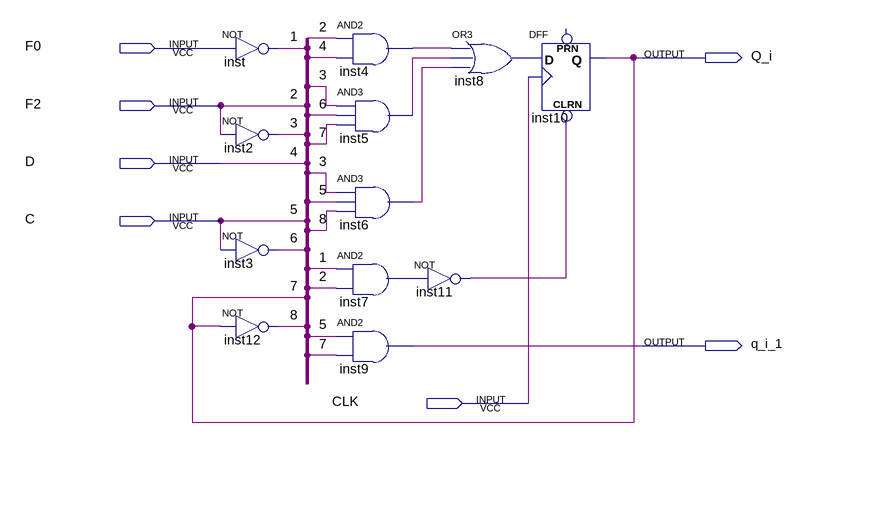
[diagram p0: schematic sheet]
// Quartus schematic CTR.bdf as structural Verilog: 12 symbols, 7 pins
module CTR (
  input  F0,
  input  F2,
  input  D,
  input  C,
  input  CLK,
  output Q_i,
  output q_i_1
);

  wire \1 , \3 , \6 , \8 , inst4_out, inst5_out, inst6_out, inst7_out, inst8_out, inst11_out;

  not inst (\1 , F0);
  not inst2 (\3 , F2);
  not inst3 (\6 , C);
  not inst12 (\8 , Q_i);
  and inst4 (inst4_out, F2, D);
  and inst5 (inst5_out, \3 , \6 , Q_i);
  and inst6 (inst6_out, \3 , C, \8 );
  and inst7 (inst7_out, \1 , F2);
  and inst9 (q_i_1, C, Q_i);
  or inst8 (inst8_out, inst4_out, inst5_out, inst6_out);
  not inst11 (inst11_out, inst7_out);
  DFF inst10 (.CLRN(inst11_out), .CLK(CLK), .D(inst8_out), .Q(Q_i));  // open: PRN

  // Other names for the same wires on the sheet: 4 = D; 5 = C; 2 = F2; 7 = Q_i
endmodule
